# Altium schematic sheet 06-User Interface.SchDoc
size A4
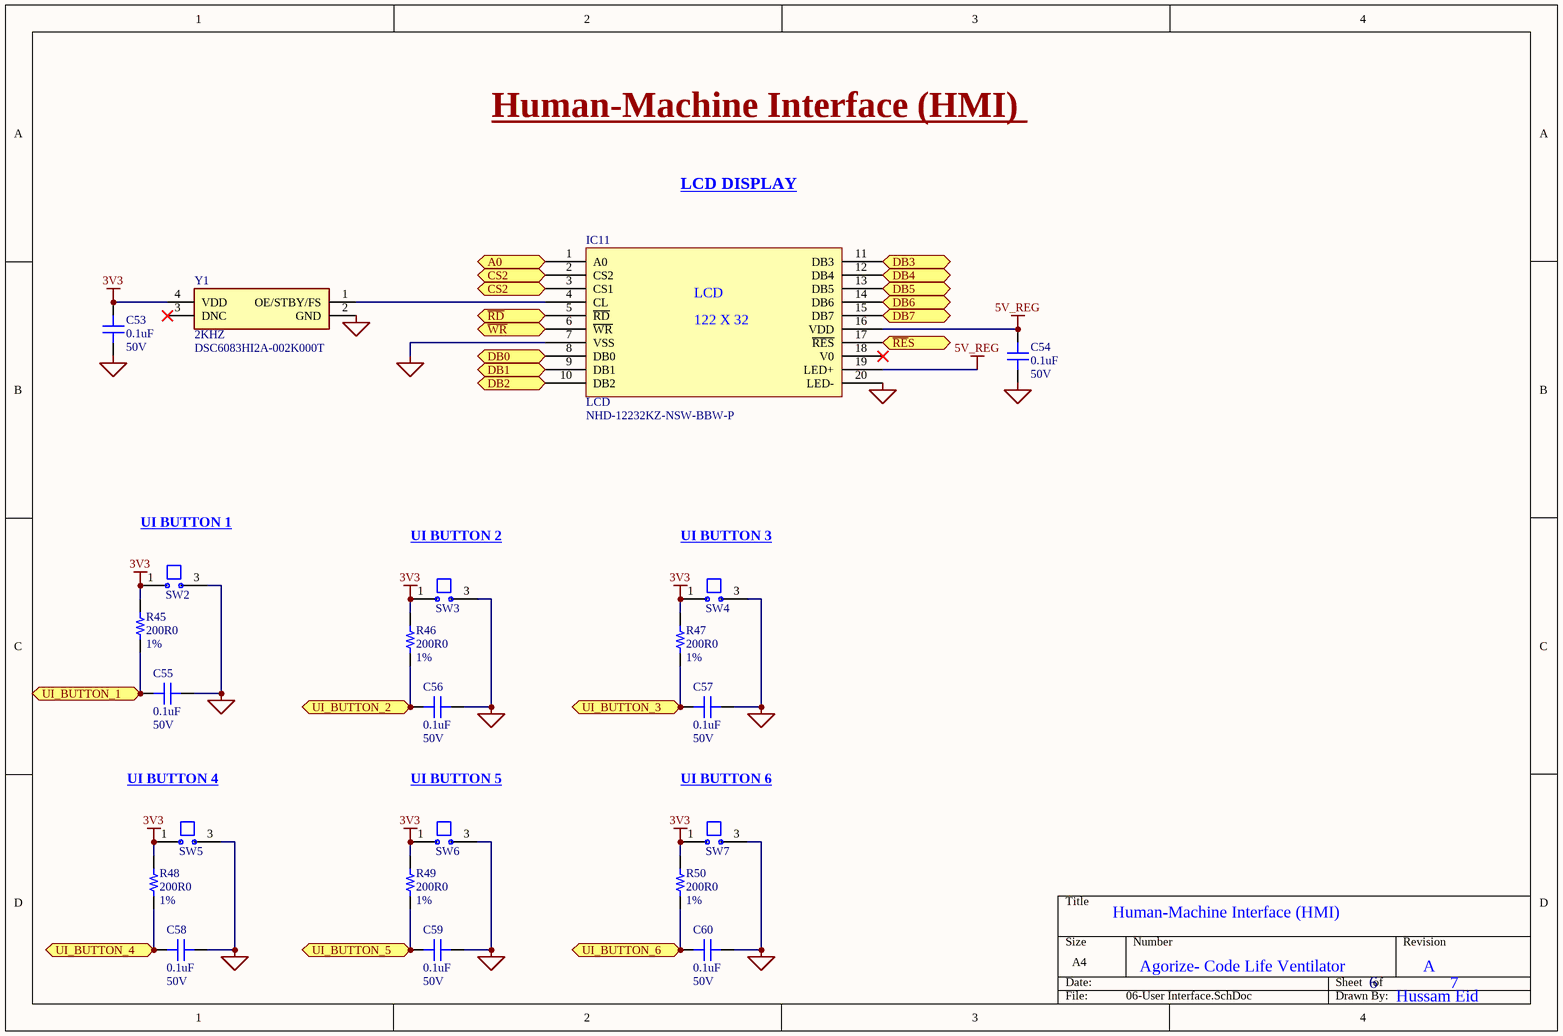
[diagram p0: 06-User Interface.SchDoc]

## Parts
C53  0.1uF  Voltage Rating: 50V  [CAP 0603/1608]
C54  0.1uF  Voltage Rating: 50V  [CAP 0603/1608]
C55  0.1uF  Voltage Rating: 50V  [CAP 0603/1608]
C56  0.1uF  Voltage Rating: 50V  [CAP 0603/1608]
C57  0.1uF  Voltage Rating: 50V  [CAP 0603/1608]
C58  0.1uF  Voltage Rating: 50V  [CAP 0603/1608]
C59  0.1uF  Voltage Rating: 50V  [CAP 0603/1608]
C60  0.1uF  Voltage Rating: 50V  [CAP 0603/1608]
IC11  LCD  Manufacturer Part Number 1: NHD-12232KZ-NSW-BBW-P  [DIP20]
R45  200R0  Tolerance: 1%  [RES 1206/3216]
R46  200R0  Tolerance: 1%  [RES 1206/3216]
R47  200R0  Tolerance: 1%  [RES 1206/3216]
R48  200R0  Tolerance: 1%  [RES 1206/3216]
R49  200R0  Tolerance: 1%  [RES 1206/3216]
R50  200R0  Tolerance: 1%  [RES 1206/3216]
SW2  Tactle switch_1  [32001E11BLK]  (value not drawn)
SW3  Tactle switch_1  [32001E11BLK]  (value not drawn)
SW4  Tactle switch_1  [32001E11BLK]  (value not drawn)
SW5  Tactle switch_1  [32001E11BLK]  (value not drawn)
SW6  Tactle switch_1  [32001E11BLK]  (value not drawn)
SW7  Tactle switch_1  [32001E11BLK]  (value not drawn)
Y1  2KHZ  Manufacturer Part Number 1: DSC6083HI2A-002K000T  [DSC6083HE1A032K800T]

## Ports
A0 (bidir), CS2 (bidir), DB0 (bidir), DB1 (bidir), DB2 (bidir), DB3 (bidir), DB4 (bidir), DB5 (bidir), DB6 (bidir), DB7 (bidir), UI_BUTTON_1 (bidir), UI_BUTTON_2 (bidir), UI_BUTTON_3 (bidir), UI_BUTTON_4 (bidir), UI_BUTTON_5 (bidir), UI_BUTTON_6 (bidir), ~{RD} (bidir), ~{RE}S (bidir), ~{WR} (bidir)

## Nets
3V3: C53.1 R45.2 R46.2 R47.2 R48.2 R49.2 R50.2 SW2.1 SW3.1 SW4.1 SW5.1 SW6.1 SW7.1 Y1.4(VDD)
5V_REG: C54.1 IC11.16(VDD) IC11.19(LED+)
COM: C53.2 C54.2 C55.2 C56.2 C57.2 C58.2 C59.2 C60.2 IC11.7(VSS) IC11.20(LED-) SW2.3 SW3.3 SW4.3 SW5.3 SW6.3 SW7.3 Y1.2(GND)
~{RD}: IC11.5(~{RD}) ; port ~{RD}
~{RE}S: IC11.17(~{RES}) ; port ~{RE}S
~{WR}: IC11.6(~{WR}) ; port ~{WR}
A0: IC11.1(A0) ; port A0
CS2: IC11.2(CS2) IC11.3(CS1) ; port CS2
DB0: IC11.8(DB0) ; port DB0
DB1: IC11.9(DB1) ; port DB1
DB2: IC11.10(DB2) ; port DB2
DB3: IC11.11(DB3) ; port DB3
DB4: IC11.12(DB4) ; port DB4
DB5: IC11.13(DB5) ; port DB5
DB6: IC11.14(DB6) ; port DB6
DB7: IC11.15(DB7) ; port DB7
UI_BUTTON_1: C55.1 R45.1 ; port UI_BUTTON_1
UI_BUTTON_2: C56.1 R46.1 ; port UI_BUTTON_2
UI_BUTTON_3: C57.1 R47.1 ; port UI_BUTTON_3
UI_BUTTON_4: C58.1 R48.1 ; port UI_BUTTON_4
UI_BUTTON_5: C59.1 R49.1 ; port UI_BUTTON_5
UI_BUTTON_6: C60.1 R50.1 ; port UI_BUTTON_6
NetIC11_4: IC11.4(CL) Y1.1(OE/STBY/FS)

Not connected (* = marked no-connect by the designer): IC11 18(V0)*; Y1 3(DNC)*

## Notes on the sheet
- Human-Machine Interface (HMI)
- LCD DISPLAY
- UI BUTTON 1
- UI BUTTON 2
- UI BUTTON 3
- UI BUTTON 4
- UI BUTTON 5
- UI BUTTON 6
- Agorize- Code Life Ventilator
- 6
- A
- 7
- Hussam Eid
- (in symbol Component_1) 122 X 32

## Library data of the parts
C53-C60 = C1608X7R1E104K080AA: CAP CER 0.1UF 50V X7R 0603; Manufacturer 1: KEMET; Manufacturer Part Number 1: C0603C104M5RACTU; Description 1: Cap Ceramic 0.1uF 50V X7R 20% SMD 0603 125C T/R; Dielectric Material: Ceramic; Capacitance: 100nF; Tolerance: 20%; Dissipation Factor: 2.5%; ComponentLink1Description: Datasheet; ComponentLink1URL: https://product.tdk.com/info/en/catalog/datasheets/mlcc_commercial_general_en.pdf; ComponentLink2Description: Digi-Key listing; ComponentLink2URL: http://digikey.com/product-detail/en/C1608X7R1E104K080AA/445-1316-1-ND/567697; Supplier 1: Digi-Key; Supplier Part Number 1: 399-7845-1-ND; RoHS 1: Yes; Stock 1: 3475152; Pricing 1: 1 = 0.10000, 10 = 0.03900, 100 = 0.01740, 500 = 0.01240, 1000 = 0.00974 (USD); Mount: Surface Mount,PCB; Case/Package: 0603; Contact Plating: Tin,Matte; Case Code (Metric): 1608; Case Code (Imperial): 0603; Min Operating Temperature: -55°C; Max Operating Temperature: 125°C; Dielectric: X7R; Termination: SMD/SMT; Package Quantity: 1; Packaging: Tape and Reel; Voltage Rating (DC): 50V; Length: 1.6mm; Height: 0.8mm; Thickness: 0.034inch; Lead Pitch: 0.7mm; Depth: 0.8mm; Width: 0.031inch; Radiation Hardening: No; REACH SVHC: No SVHC; ComponentLink3URL: https://www.verical.com/server-webapp/html/getDatasheet?partID=626892&src-supplier=Verical; ComponentLink3Description: https://www.verical.com/server-webapp/html/getDatasheet?partID=626892&src-supplier=Verical; ComponentLink4URL: http://www.farnell.com/datasheets/2746056.pdf?src-supplier=Farnell; ComponentLink4Description: http://www.farnell.com/datasheets/2746056.pdf?src-supplier=Farnell; ComponentLink5URL: http://components.arrow.com/part/dataview/0323_00313986?src-supplier=Arrow+Europe; ComponentLink5Description: http://components.arrow.com/part/dataview/0323_00313986?src-supplier=Arrow+Europe; ComponentLink6URL: http://www.mouser.com/ds/2/212/KEM_C1002_X7R_SMD-1102033.pdf?src-supplier=Mouser; ComponentLink6Description: http://www.mouser.com/ds/2/212/KEM_C1002_X7R_SMD-1102033.pdf?src-supplier=Mouser; ComponentLink7URL: http://www.alliedelec.com/m/d/6f3b5eb83d09db50ed28bdc730567b33.pdf?src-supplier=Allied+Electronics; ComponentLink7Description: http://www.alliedelec.com/m/d/6f3b5eb83d09db50ed28bdc730567b33.pdf?src-supplier=Allied+Electronics; ComponentLink8URL: http://components.arrow.com/part/dataview/40911037S8853915N7429?src-supplier=Arrow; ComponentLink8Description: http://components.arrow.com/part/dataview/40911037S8853915N7429?src-supplier=Arrow; ComponentLink9URL: http://www.farnell.com/datasheets/2746056.pdf?src-supplier=Newark; ComponentLink9Description: http://www.farnell.com/datasheets/2746056.pdf?src-supplier=Newark; ComponentLink10URL: http://www.farnell.com/datasheets/1828800.pdf?src-supplier=Newark; ComponentLink10Description: http://www.farnell.com/datasheets/1828800.pdf?src-supplier=Newark; ComponentLink11URL: http://capacitoredge.kemet.com/capedge2/DataSheet?pn=C0603C104M5RAC7867&src-supplier=Avnet+Asia; ComponentLink11Description: http://capacitoredge.kemet.com/capedge2/DataSheet?pn=C0603C104M5RAC7867&src-supplier=Avnet+Asia; ComponentLink12URL: https://api.kemet.com/component-edge/download/datasheet/C0603C104M5RACTU.pdf?src-supplier=Digi-Key; ComponentLink12Description: https://api.kemet.com/component-edge/download/datasheet/C0603C104M5RACTU.pdf?src-supplier=Digi-Key; ComponentLink13URL: https://www.verical.com/server-webapp/html/getDatasheet?partID=110138&src-supplier=Verical; ComponentLink13Description: https://www.verical.com/server-webapp/html/getDatasheet?partID=110138&src-supplier=Verical; ComponentLink14URL: http://capacitoredge.kemet.com/capedge2/DataSheet?pn=C0603C104M5RAC7867&src-supplier=Avnet; ComponentLink14Description: http://capacitoredge.kemet.com/capedge2/DataSheet?pn=C0603C104M5RAC7867&src-supplier=Avnet; ComponentLink15URL: http://www.farnell.com/datasheets/2315113.pdf?src-supplier=Newark; ComponentLink15Description: http://www.farnell.com/datasheets/2315113.pdf?src-supplier=Newark; ComponentLink16URL: http://www.farnell.com/datasheets/2746056.pdf?src-supplier=Element14; ComponentLink16Description: http://www.farnell.com/datasheets/2746056.pdf?src-supplier=Element14
IC11 = Component_1: LCD MOD GRAPH 122X32 WH TRANSM; Manufacturer 1: Newhaven Display; Description 1: 122 by 32 Character LCD Display Module 5 Volts White Letters; Interface: Parallel,8 bit; Background Color: Blue; Resolution (height): 32pixel; Resolution (width): 122pixel; Backlight Type: LED; Supplier 1: Digi-Key; Supplier Part Number 1: NHD-12232KZ-NSW-BBW-P-ND; RoHS 1: Yes; Stock 1: 610; Pricing 1: 1 = 13.85000, 5 = 13.01800, 10 = 12.18700, 50 = 11.60400 (USD); Case/Package: Module; Min Operating Temperature: -20°C; Max Operating Temperature: 70°C; Packaging: Bulk; Package Quantity: 50; ComponentLink1URL: https://datasheet.ciiva.com/19454/2154919-19454139.pdf?src-supplier=Jameco; ComponentLink1Description: https://datasheet.ciiva.com/19454/2154919-19454139.pdf?src-supplier=Jameco; ComponentLink2URL: https://datasheet.ciiva.com/5326/nhd-12232kz-nsw-bbw-p-44813-5326535.pdf?src-supplier=Mouser; ComponentLink2Description: https://datasheet.ciiva.com/5326/nhd-12232kz-nsw-bbw-p-44813-5326535.pdf?src-supplier=Mouser; ComponentLink3URL: https://datasheet.ciiva.com/2103/nhd-12232kz-nsw-bbw-p-2103129.pdf?src-supplier=Digi-Key; ComponentLink3Description: https://datasheet.ciiva.com/2103/nhd-12232kz-nsw-bbw-p-2103129.pdf?src-supplier=Digi-Key; ComponentLink4URL: https://datasheet.ciiva.com/49271/70518174-49271942.pdf?src-supplier=Allied+Electronics; ComponentLink4Description: https://datasheet.ciiva.com/49271/70518174-49271942.pdf?src-supplier=Allied+Electronics
R45-R50 = ERJ-8ENF1002V: RES SMD 10K OHM 1% 1/4W 1206; Manufacturer 1: Yageo; Manufacturer Part Number 1: RC1206FR-07200RL; Description 1: Res Thick Film 1206 200 Ohm 1% 0.25W(1/4W) ±100ppm/C Molded SMD Paper T/R; Temperature Coefficient: 100ppm/°C; Resistance: 200R; Voltage Rating (DC): 200V; Power Rating: 250mW; ComponentLink1Description: Datasheet; ComponentLink1URL: http://industrial.panasonic.com/www-cgi/jvcr13pz.cgi?E+PZ+3+AOA0002+ERJ8ENF1002V+7+WW; ComponentLink2Description: Digi-Key listing; ComponentLink2URL: http://digikey.com/product-detail/en/ERJ-8ENF1002V/P10.0KFTR-ND/89059; Supplier 1: Digi-Key; Supplier Part Number 1: 311-200FRCT-ND; RoHS 1: Yes; Stock 1: 2870115; Pricing 1: 1 = 0.10000, 10 = 0.07100, 100 = 0.02910, 1000 = 0.01306, 2500 = 0.01134 (USD); Mount: Surface Mount; Case/Package: 1206; Weight: 0.000571oz; Case Code (Metric): 3216; Case Code (Imperial): 1206; Min Operating Temperature: -55°C; Max Operating Temperature: 155°C; Composition: Thick Film; Packaging: Tape and Reel; Termination: SMD/SMT; Military Standard: Not; Voltage Rating: 200V; Length: 3.1mm; Height: 0.55mm; Width: 1.6mm; Depth: 1.6mm; Lead Free: Lead Free; ComponentLink3URL: https://datasheet.ciiva.com/11808/0900766b80c6630a-11808603.pdf?src-supplier=RSComponents; ComponentLink3Description: https://datasheet.ciiva.com/11808/0900766b80c6630a-11808603.pdf?src-supplier=RSComponents
SW2-SW7 = Tactle switch_1: SWITCH TACT SPST-NO 0.025A 50V; Manufacturer 1: E-Switch; Manufacturer Part Number 1: 320E11BLK; Description 1: Switch Tactile N.O. SPST Square Button PC Pins 0.025A 50VDC 1.32N Thru-Hole; Mechanical Life: 1000000Cycles; Actuator Material: PC,Polycarbonate; Illumination Type: Non-Illuminated; Throw Configuration: SPST; Contact Resistance: 50mR; Operating Force: 135gf; Current Rating: 25mA; Switch Function: Off-Mom; Switch Travel: 0.6mm; Actuator Length: 2.55mm; Supplier 1: Digi-Key; Supplier Part Number 1: EG1301-ND; RoHS 1: Yes; Stock 1: 1989; Pricing 1: 1 = 1.43000, 10 = 1.33800, 25 = 1.27400, 50 = 1.21040, 100 = 1.17850, 250 = 1.14660, 500 = 1.08290, 1000 = 1.01920, 5000 = 0.85995 (USD); Mount: Through Hole; Contact Material: Copper Alloy,Copper,Silver; Contact Plating: Silver; Housing Material: Nylon; Color: Black; Min Operating Temperature: -20°C; Max Operating Temperature: 70°C; Termination: PC Pin; Voltage Rating (DC): 50V; Electrical Life: 1000000Cycles; Package Quantity: 1; Packaging: Bulk; Orientation: Straight; Max Voltage Rating (DC): 50V; Length: 12.5mm; Width: 12.5mm; Lead Free: Lead Free; ComponentLink1URL: https://datasheet.ciiva.com/16154/xb0016p-16154688.pdf?src-supplier=Onlinecomponents.com; ComponentLink1Description: https://datasheet.ciiva.com/16154/xb0016p-16154688.pdf?src-supplier=Onlinecomponents.com
Y1 = DSC6083HE1A-032K800T: MEMS OSC XO 2.0000KHZ CMOS SMD; Manufacturer 1: Microchip; Supplier 1: Digi-Key; Supplier Part Number 1: DSC6083HI2A-002K000TCT-ND; RoHS 1: No; Description 1: MEMS OSC XO 2.0000KHZ CMOS SMD; Stock 1: 822; Pricing 1: 1 = 1.17000, 25 = 0.97000, 100 = 0.88000 (USD); ComponentLink1URL: http://www.microchip.com/mymicrochip/filehandler.aspx?ddocname=en587489&src-supplier=Digi-Key; ComponentLink1Description: http://www.microchip.com/mymicrochip/filehandler.aspx?ddocname=en587489&src-supplier=Digi-Key